# EAGLE schematic raspi (EAGLE 6.3)
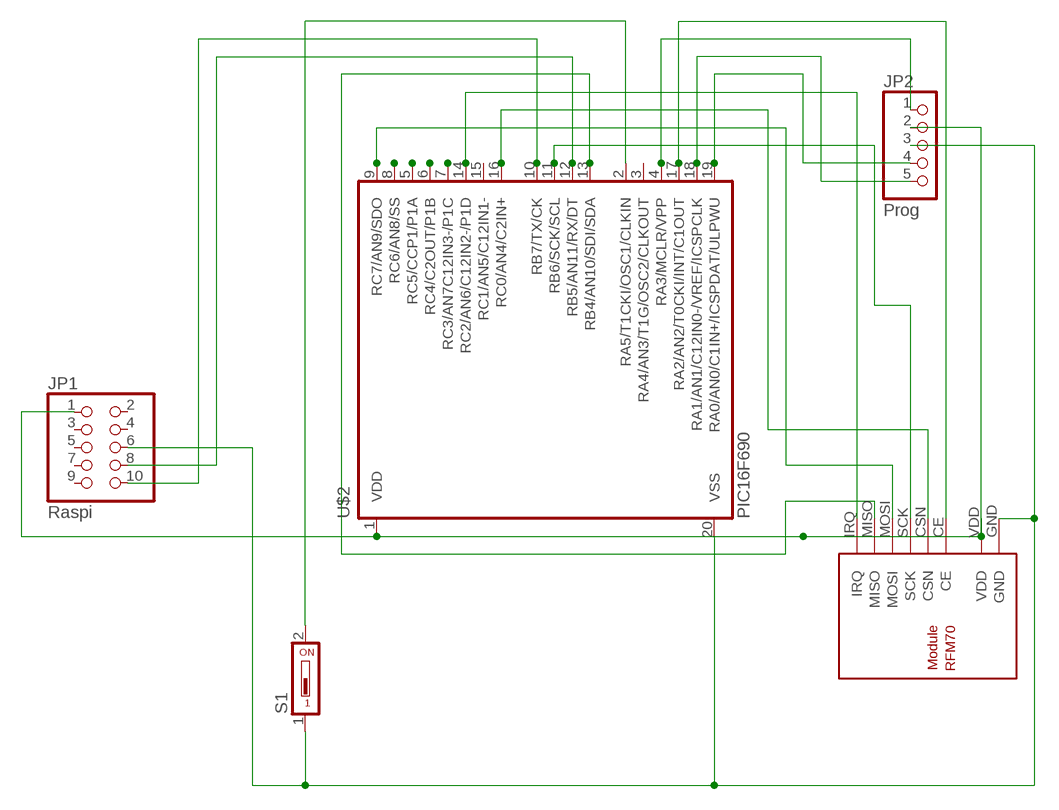
[diagram p0: schematic, sheet 1]

## Parts
JP1  Raspi  PINHD-2X5  [2X05]
JP2  Prog  PINHD-1X5  [1X05]
S1  SD4-01  [SD4-01]
U$1  RFM70  [RFM70]
U$2  PIC16F690  [SSOP20]

## Nets
N$1: S1.2 U$2.2(RA5/T1CKI/OSC1/CLKIN)
N$5: JP1.6 JP2.3 S1.1 U$1.GND U$2.20(VSS)
N$12: U$1.MISO U$2.13(RB4/AN10/SDI/SDA)
N$16: U$1.CE U$2.17(RA2/AN2/T0CKI/INT/C1OUT)
N$17: JP1.1 JP2.2 U$1.VDD U$2.1(VDD)
N$18: JP2.4 U$2.19(RA0/AN0/C1IN+/ICSPDAT/ULPWU)
N$19: JP2.5 U$2.18(RA1/AN1/C12IN0-/VREF/ICSPCLK)
N$20: U$1.CSN U$2.16(RC0/AN4/C2IN+)
N$21: U$1.IRQ U$2.14(RC2/AN6/C12IN2-/P1D)
N$22: U$1.SCK U$2.11(RB6/SCK/SCL)
N$23: U$1.MOSI U$2.9(RC7/AN9/SDO)
N$25: JP2.1 U$2.4(RA3/MCLR/VPP)
N$28: U$2.8(RC6/AN8/SS)
N$29: U$2.5(RC5/CCP1/P1A)
N$30: U$2.6(RC4/C2OUT/P1B)
N$31: U$2.7(RC3/AN7C12IN3-/P1C)
N$33: JP1.10 U$2.10(RB7/TX/CK)
N$34: JP1.8 U$2.12(RB5/AN11/RX/DT)
Unconnected: JP1.2 JP1.3 JP1.4 JP1.5 JP1.7 JP1.9 U$2.3(RA4/AN3/T1G/OSC2/CLKOUT) U$2.15(RC1/AN5/C12IN1-)

## Library data of the parts
JP1 = pinhead:PINHD-2X5: PIN HEADER
JP2 = pinhead:PINHD-1X5: PIN HEADER
S1 = switch-dil:SD4-01: DIL/CODE SWITCH; OC_FARNELL: unknown; OC_NEWARK: unknown
U$1 = rfm70:RFM70: RFM70 2.4 Ghz Funkmodul Autor: Daniel Weber Website: http://projects.web4clans.com Email: daniel.weber@web4clans.com
U$2 = microchip:PIC16F690*: MICROCONTROLLER PIC16F690 18 I/O One 16-bit timer Two 8-bit timer Two comparators Precision internal oscillator-software selectable 8 MHz - 32 KHz SSP w/ I2C Compatible Address mask option EUSART LIN 2.0 Compatible ECCP+ w/ PWM Steering 12 A/D Channels ULPW Enhanced Low Power Timer 1 Timer 1 Gate Synch Latch 4k Program Flash memory 256 bytes SRAM 256 bytes EEPROM